# Altium schematic sheet headers_botones.SchDoc
size A4
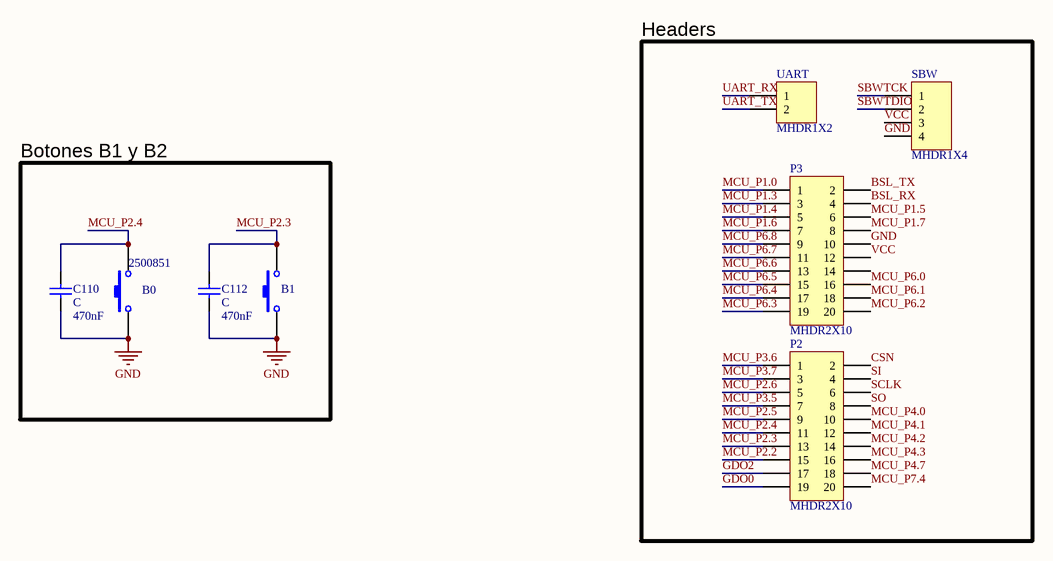
[diagram p0: headers_botones.SchDoc]

## Parts
B0  Supplier Part Number 1: 2500851  [PushButton]  (hidden comment: Pulsador)
B1  Pulsador  [pushbutton]  (value not drawn)
C110  C  value 470nF  [0805 CAP]
C112  C  value 470nF  [0805 CAP]
P2  MHDR2X10  [HDR2X10]
P3  MHDR2X10  [HDR2X10]
SBW  MHDR1X4  [HDR1X4]
UART  MHDR1X2  [HDR1X2]

## Blocks framed on the sheet
Headers: P2 P3 SBW UART
Botones B1 y B2: B0 B1 C110 C112

## Nets
GND: B0.1 B1.1 C110.1 C112.1 P3.10 SBW.4
BSL_RX: P3.4
BSL_TX: P3.2
CSN: P2.2
GDO0: P2.19
GDO2: P2.17
MCU_P1.0: P3.1
MCU_P1.3: P3.3
MCU_P1.4: P3.5
MCU_P1.5: P3.6
MCU_P1.6: P3.7
MCU_P1.7: P3.8
MCU_P2.2: P2.15
MCU_P2.3: B1.2 C112.2 P2.13
MCU_P2.4: B0.2 C110.2 P2.11
MCU_P2.5: P2.9
MCU_P2.6: P2.5
MCU_P3.5: P2.7
MCU_P3.6: P2.1
MCU_P3.7: P2.3
MCU_P4.0: P2.10
MCU_P4.1: P2.12
MCU_P4.2: P2.14
MCU_P4.3: P2.16
MCU_P4.7: P2.18
MCU_P6.0: P3.16
MCU_P6.1: P3.18
MCU_P6.2: P3.20
MCU_P6.3: P3.19
MCU_P6.4: P3.17
MCU_P6.5: P3.15
MCU_P6.6: P3.13
MCU_P6.7: P3.11
MCU_P6.8: P3.9
MCU_P7.4: P2.20
SBWTCK: SBW.1
SBWTDIO: SBW.2
SCLK: P2.6
SI: P2.4
SO: P2.8
UART_RX: UART.1
UART_TX: UART.2
VCC: P3.12 SBW.3

Not connected (* = marked no-connect by the designer): P3 14

## Library data of the parts
B0 B1 = Pulsador_1: Switch; Manufacturer: Generic Components; Published: 1999
  B0: Supplier 1: Farnell
C110 C112 = C: Capacitor; Manufacturer: Generic Components; Class: Passive; Published: 08/06/2000; Publisher: Altium Hobart Technology Centre; SubClass: Capacitor
P2 P3 = MHDR2X10: Header, 10-Pin, Dual row; LatestRevisionDate: 17-Jul-2002; LatestRevisionNote: Re-released for DXP Platform.; Publisher: Altium Limited
SBW = MHDR1X4: Header, 4-Pin; LatestRevisionDate: 17-Jul-2002; LatestRevisionNote: Re-released for DXP Platform.; Publisher: Altium Limited
UART = MHDR1X2: Header, 2-Pin; LatestRevisionDate: 17-Jul-2002; LatestRevisionNote: Re-released for DXP Platform.; Publisher: Altium Limited